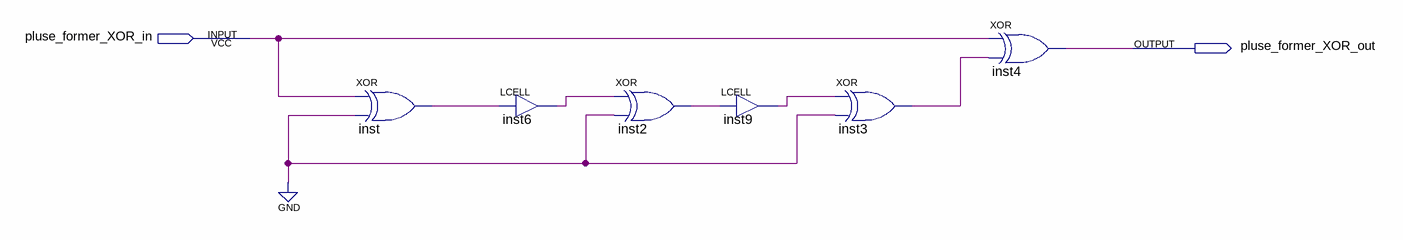
[diagram p0: schematic sheet]
// Quartus schematic pluse_former_XOR.bdf as structural Verilog: 6 symbols, 2 pins
module pluse_former_XOR (
  input  pluse_former_XOR_in,
  output pluse_former_XOR_out
);

  wire inst2_out, inst3_out, inst6_out, inst9_out, inst_out;

  xor inst (inst_out, pluse_former_XOR_in, 1'b0);
  LCELL inst6 (.IN(inst_out), .OUT(inst6_out));
  xor inst2 (inst2_out, inst6_out, 1'b0);
  LCELL inst9 (.IN(inst2_out), .OUT(inst9_out));
  xor inst3 (inst3_out, inst9_out, 1'b0);
  xor inst4 (pluse_former_XOR_out, pluse_former_XOR_in, inst3_out);
endmodule
